# Altium schematic sheet esp32_c6_a1_SoC.SchDoc
size A3; SheetNumber: 2; SheetTotal: 4
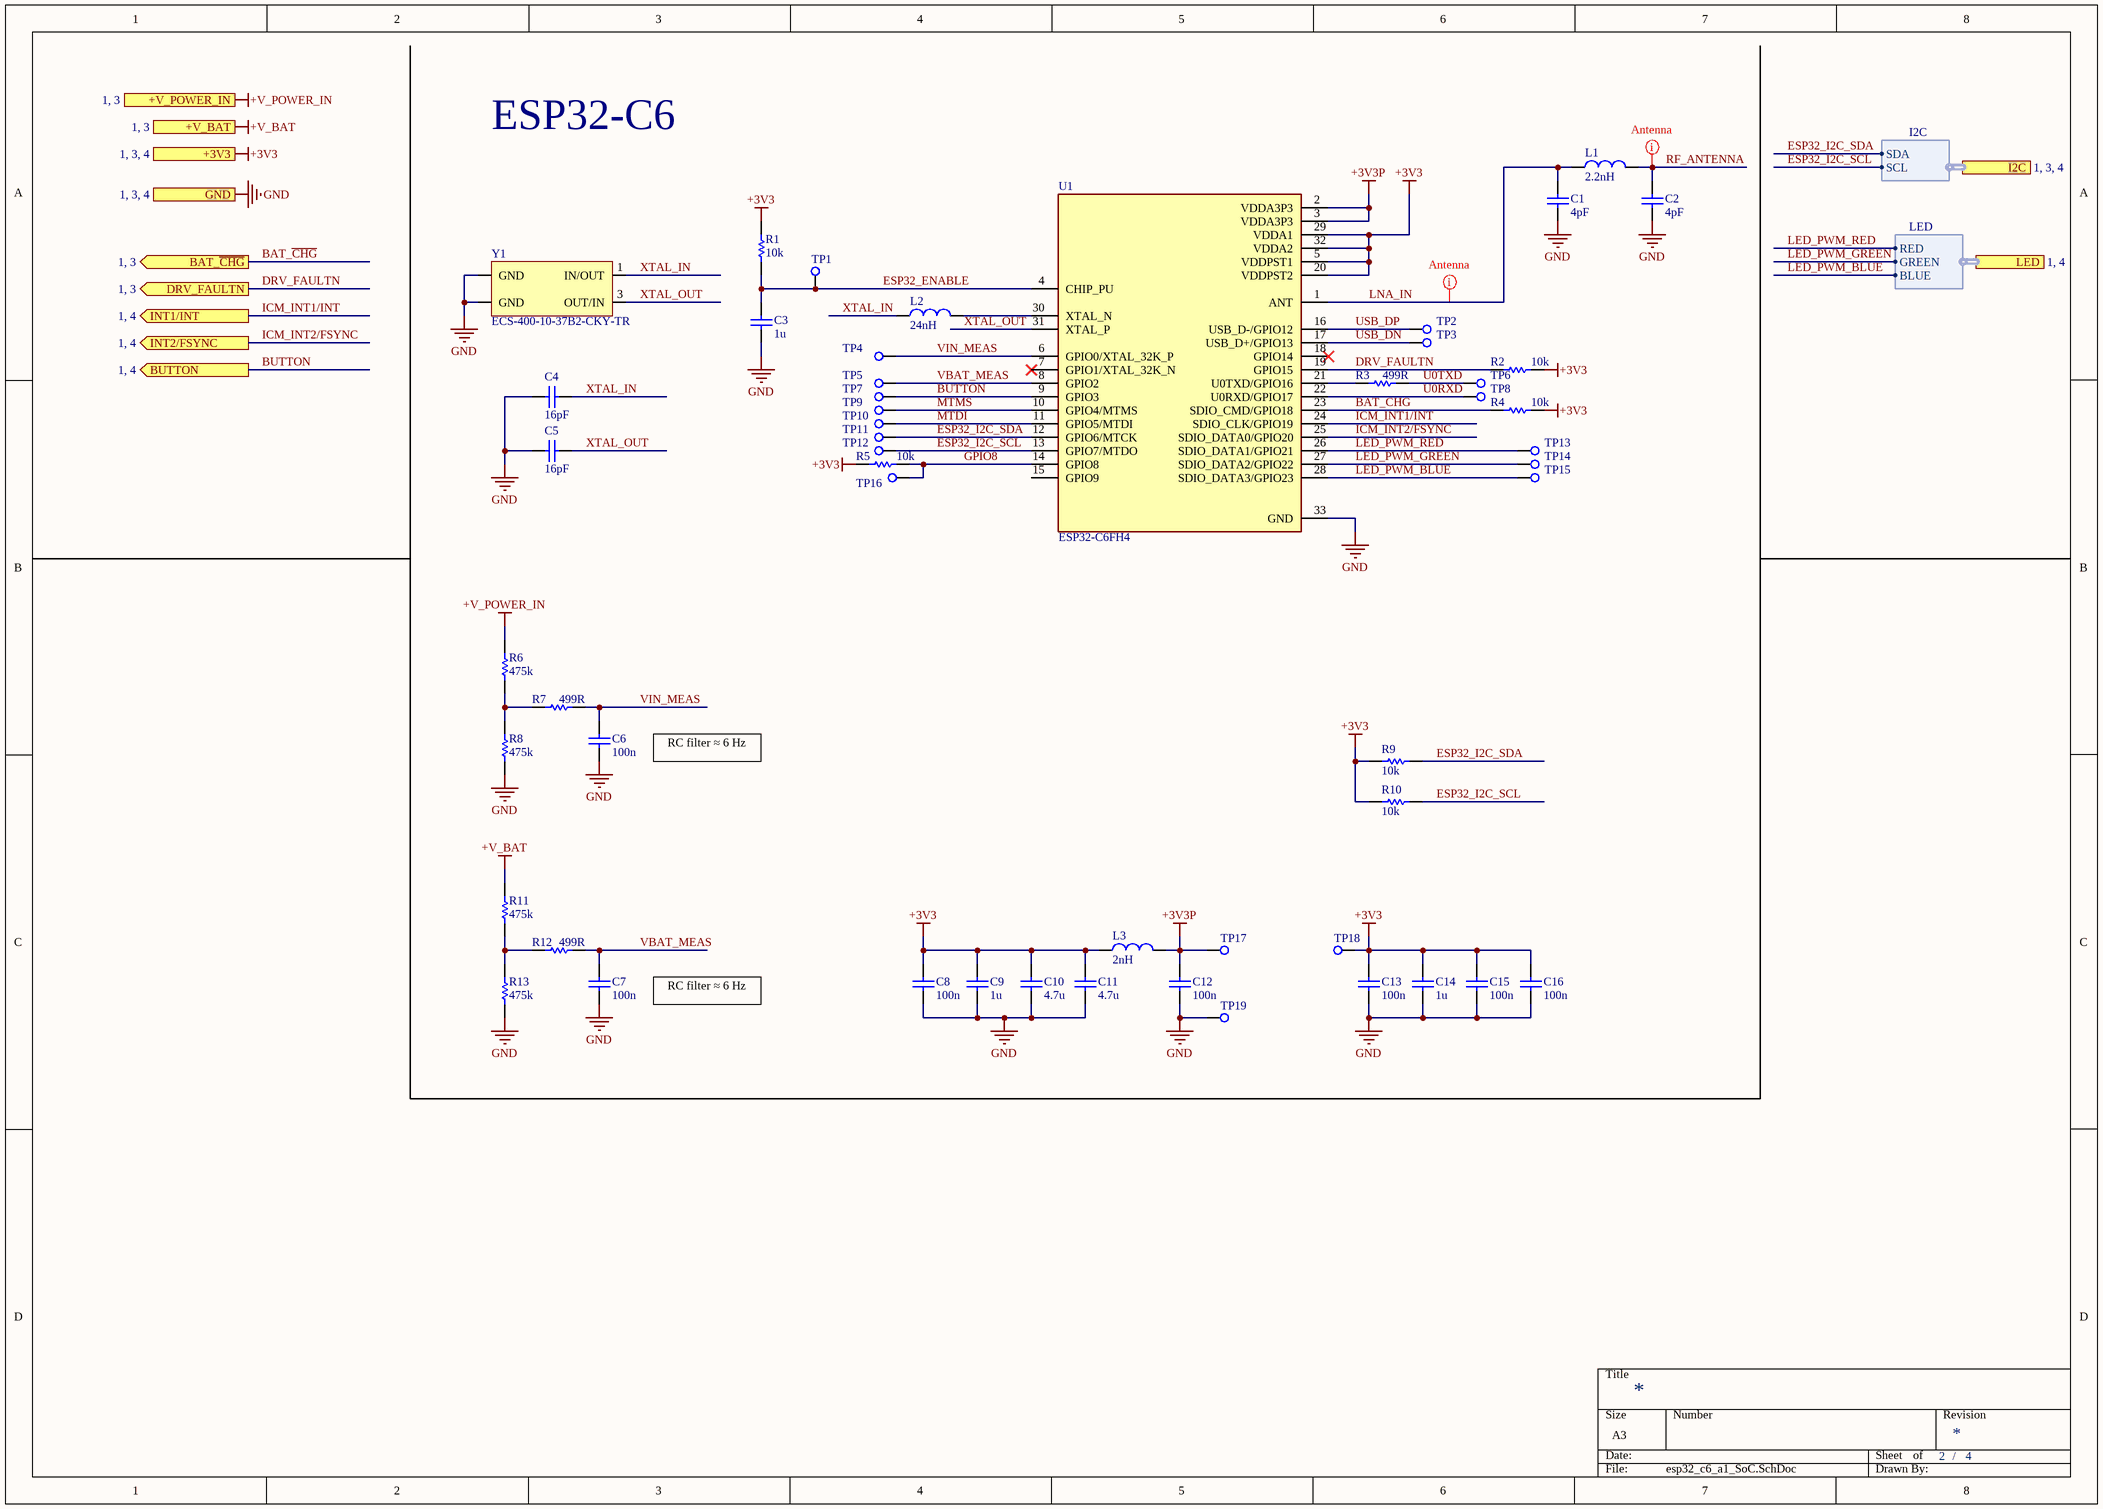
[diagram p0: esp32_c6_a1_SoC.SchDoc]

## Parts
C1  value 4pF  [C_0201]  (hidden comment: 0201)
C2  value 4pF  [C_0201]  (hidden comment: 0201)
C3  value 1u  [C_0603]  (hidden comment: 0603)
C4  value 16pF  [C_0402]  (hidden comment: 0402)
C5  value 16pF  [C_0402]  (hidden comment: 0402)
C6  value 100n  [C_0402]  (hidden comment: 0402)
C7  value 100n  [C_0402]  (hidden comment: 0402)
C8  value 100n  [C_0402]  (hidden comment: 0402)
C9  value 1u  [C_0603]  (hidden comment: 0603)
C10  value 4.7u  [C_0603]  (hidden comment: 0603)
C11  value 4.7u  [C_0603]  (hidden comment: 0603)
C12  value 100n  [C_0402]  (hidden comment: 0402)
C13  value 100n  [C_0402]  (hidden comment: 0402)
C14  value 1u  [C_0603]  (hidden comment: 0603)
C15  value 100n  [C_0402]  (hidden comment: 0402)
C16  value 100n  [C_0402]  (hidden comment: 0402)
L1  value 2.2nH  [L_0201]  (hidden comment: 0201)
L2  value 24nH  [L_0201]  (hidden comment: 0201)
L3  value 2nH  [L_0402]  (hidden comment: 0402)
R1  value 10k  [R_0402]  (hidden comment: 0402)
R2  value 10k  [R_0402]  (hidden comment: 0402)
R3  value 499R  [R_0402]  (hidden comment: 0402)
R4  value 10k  [R_0402]  (hidden comment: 0402)
R5  value 10k  [R_0402]  (hidden comment: 0402)
R6  value 475k  [R_0402]  (hidden comment: 0402)
R7  value 499R  [R_0402]  (hidden comment: 0402)
R8  value 475k  [R_0402]  (hidden comment: 0402)
R9  value 10k  [R_0402]  (hidden comment: 0402)
R10  value 10k  [R_0402]  (hidden comment: 0402)
R11  value 475k  [R_0402]  (hidden comment: 0402)
R12  value 499R  [R_0402]  (hidden comment: 0402)
R13  value 475k  [R_0402]  (hidden comment: 0402)
TP1  TP  [tp_round_80]  (value not drawn)  (no BOM)
TP2  TP  [tp_round_80]  (value not drawn)  (no BOM)
TP3  TP  [tp_round_80]  (value not drawn)  (no BOM)
TP4  TP  [tp_round_80]  (value not drawn)  (no BOM)
TP5  TP  [tp_round_80]  (value not drawn)  (no BOM)
TP6  TP  [tp_round_80]  (value not drawn)  (no BOM)
TP7  TP  [tp_round_80]  (value not drawn)  (no BOM)
TP8  TP  [tp_round_80]  (value not drawn)  (no BOM)
TP9  TP  [tp_round_80]  (value not drawn)  (no BOM)
TP10  TP  [tp_round_80]  (value not drawn)  (no BOM)
TP11  TP  [tp_round_80]  (value not drawn)  (no BOM)
TP12  TP  [tp_round_80]  (value not drawn)  (no BOM)
TP13  TP  [tp_round_80]  (value not drawn)  (no BOM)
TP14  TP  [tp_round_80]  (value not drawn)  (no BOM)
TP15  TP  [tp_round_80]  (value not drawn)  (no BOM)
TP16  TP  [tp_round_80]  (value not drawn)  (no BOM)
TP17  TP  [tp_round_80]  (value not drawn)  (no BOM)
TP18  TP  [tp_round_80]  (value not drawn)  (no BOM)
TP19  TP  [tp_round_80]  (value not drawn)  (no BOM)
U1  ESP32-C6FH4  [QFN50P500X500X90-33N]
Y1  ECS-400-10-37B2-CKY-TR  [XTAL_ECS-400-10-37B2-CKY-TR]

## Ports
+3V3 (see 1, 3, 4), +V_BAT (see 1, 3), +V_POWER_IN (see 1, 3), BAT_~{CHG} (out, see 1, 3), BUTTON (out, see 1, 4), DRV_FAULTN (out, see 1, 3), GND (see 1, 3, 4), I2C (harness I2C, see 1, 3, 4), INT1/INT (out, see 1, 4), INT2/FSYNC (out, see 1, 4), LED (harness LED, see 1, 4)

## Harnesses
I2C: SDA, SCL
LED: RED, GREEN, BLUE

## Nets
+3V3: C8.2 C9.2 C10.2 C11.2 C13.2 C14.2 C15.2 C16.2 L3.1 R1.2 R2.2 R4.2 R5.1 R9.2 R10.2 TP18.1 U1.5(VDDPST1) U1.20(VDDPST2) U1.29(VDDA1) U1.32(VDDA2) ; port +3V3
+3V3P: C12.2 L3.2 TP17.1 U1.2(VDDA3P3) U1.3(VDDA3P3)
+V_BAT: R11.2 ; port +V_BAT
+V_POWER_IN: R6.2 ; port +V_POWER_IN
GND: C1.1 C2.1 C3.1 C4.2 C5.2 C6.1 C7.1 C8.1 C9.1 C10.1 C11.1 C12.1 C13.1 C14.1 C15.1 C16.1 R8.1 R13.1 TP19.1 U1.33(GND) Y1.2(GND) Y1.4(GND) ; port GND
BAT_~{CHG}: R4.1 U1.23(SDIO_CMD/GPIO18) ; port BAT_~{CHG}
BUTTON: TP7.1 U1.9(GPIO3) ; port BUTTON
DRV_FAULTN: R2.1 U1.19(GPIO15) ; port DRV_FAULTN
ESP32_ENABLE: C3.2 R1.1 TP1.1 U1.4(CHIP_PU)
ESP32_I2C_SCL: R10.1 TP12.1 U1.13(GPIO7/MTDO) ; port I2C.SCL
ESP32_I2C_SDA: R9.1 TP11.1 U1.12(GPIO6/MTCK) ; port I2C.SDA
GPIO8: R5.2 TP16.1 U1.14(GPIO8)
ICM_INT1/INT: U1.24(SDIO_CLK/GPIO19) ; port INT1/INT
ICM_INT2/FSYNC: U1.25(SDIO_DATA0/GPIO20) ; port INT2/FSYNC
LED_PWM_BLUE: TP15.1 U1.28(SDIO_DATA3/GPIO23) ; port LED.BLUE
LED_PWM_GREEN: TP14.1 U1.27(SDIO_DATA2/GPIO22) ; port LED.GREEN
LED_PWM_RED: TP13.1 U1.26(SDIO_DATA1/GPIO21) ; port LED.RED
LNA_IN: C1.2 L1.1 U1.1(ANT)
MTDI: TP10.1 U1.11(GPIO5/MTDI)
MTMS: TP9.1 U1.10(GPIO4/MTMS)
RF_ANTENNA: C2.2 L1.2
U0RXD: TP8.1 U1.22(U0RXD/GPIO17)
U0TXD: R3.2 TP6.1
USB_DN: TP3.1 U1.17(USB_D+/GPIO13)
USB_DP: TP2.1 U1.16(USB_D-/GPIO12)
VBAT_MEAS: C7.2 R12.2 TP5.1 U1.8(GPIO2)
VIN_MEAS: C6.2 R7.2 TP4.1 U1.6(GPIO0/XTAL_32K_P)
XTAL_IN: C4.1 L2.1 Y1.1(IN/OUT)
XTAL_OUT: C5.1 U1.31(XTAL_P) Y1.3(OUT/IN)
NetL2_2: L2.2 U1.30(XTAL_N)
NetR3_1: R3.1 U1.21(U0TXD/GPIO16)
NetR6_1: R6.1 R7.1 R8.2
NetR11_1: R11.1 R12.1 R13.2

Not connected (* = marked no-connect by the designer): U1 7(GPIO1/XTAL_32K_N)* 15(GPIO9) 18(GPIO14)*

## Layout directives
net class Antenna: LNA_IN, RF_ANTENNA

## Notes on the sheet
- ESP32-C6
- The crystal should operate flawlessly to maximize RF performance. Please verify this again using Espressif's test software.
- RC filter ≈ 6 Hz
- /

## Library data of the parts
C1 C2 = C_0201: SMD 0201 Ceramic Chip Capacitor; Manufacturer: Murata; MPN: GRM0335C1H4R0BA01D; Cad Data: ?; Part Number: ?; List Code: ?
C3 C9 C14 = C_0603: SMD 0603 Ceramic Chip Capacitor; Manufacturer: Samsung; MPN: CL10B105KP8NNNC; Cad Data: ?; Part Number: ?; List Code: ?
C4 C5 = C_0402: SMD 0402 Ceramic Chip Capacitor; Manufacturer: Murata; MPN: GJM1555C1H160FB01J; Cad Data: ?; Part Number: ?; List Code: ?
C6-C8 C12 C13 C15 C16 = C_0402: SMD 0402 Ceramic Chip Capacitor; Manufacturer: Samsung; MPN: CL05B104KP5NNNC; Cad Data: ?; Part Number: ?; List Code: ?
C10 C11 = C_0603: SMD 0603 Ceramic Chip Capacitor; Manufacturer: Samsung; MPN: CL10A475KP8NNNC; Cad Data: ?; Part Number: ?; List Code: ?
L1 = L_0201: SMD 0201 Inductor; Manufacturer: Murata; MPN: LQP03TN2N2B02D; Cad Data: ?; Part Number: ?; List Code: ?
L2 = L_0201: SMD 0201 Inductor; Manufacturer: Murata; MPN: LQP03TN24NH02D; Cad Data: ?; Part Number: ?; List Code: ?
L3 = L_0402: SMD 0402 Inductor; Manufacturer: Murata; MPN: LQG15HN2N0C02D; Cad Data: ?; Part Number: ?; List Code: ?
R1 R2 R4 R5 R9 R10 = R_0402: SMD 0402 Rectangular Thick Film Chip Resistor; Manufacturer: Yageo; MPN: RC0402FR-0710KL; Cad Data: ?; Part Number: ?; List Code: ?
R3 R7 R12 = R_0402: SMD 0402 Rectangular Thick Film Chip Resistor; Manufacturer: Yageo; MPN: RC0402FR-07499RL; Cad Data: ?; Part Number: ?; List Code: ?
R6 R8 R11 R13 = R_0402: SMD 0402 Rectangular Thick Film Chip Resistor; Manufacturer: Yageo; MPN: RC0402FR-07475KL; Cad Data: ?; Part Number: ?; List Code: ?
TP1-TP19 = TP: Test Point
U1 = ESP32-C6FH4: 802.15.4, Bluetooth, WiFi 802.11ax, Bluetooth v5.0, ZigbeeÂ® Transceiver Module 2.4GHz Antenna Not Included Surface Mount; Manufacturer: Espressif Systems; Package: None; Price: None; Check_prices: https://www.snapeda.com/parts/ESP32-C6FH4/Espressif+Systems/view-part/?ref=eda; Value: *; SnapEDA_Link: https://www.snapeda.com/parts/ESP32-C6FH4/Espressif+Systems/view-part/?ref=snap; MPN: ESP32-C6FH4; Availability: In Stock; Purchase-URL: https://pricing.snapeda.com/search?q=ESP32-C6FH4&ref=eda
Y1 = ECS-400-10-37B2-CKY-TR: 40 MHz Â±10ppm Crystal 10pF 40 Ohms 4-SMD, No Lead; Manufacturer: ECS Inc.; MPN: ECS-400-10-37B2-CKY-TR; Package: None; Digi-Key_Part_Number: 50-ECS-400-10-37B2-CKY-TR-ND; Check_prices: https://www.snapeda.com/parts/ECS-400-10-37B2-CKY-TR/ECS+Inc./view-part/?ref=eda; Purchase-URL: https://pricing.snapeda.com/search/part/ECS-400-10-37B2-CKY-TR/?ref=eda; SnapEDA_Link: https://www.snapeda.com/parts/ECS-400-10-37B2-CKY-TR/ECS+Inc./view-part/?ref=snap; Value: *